# EAGLE schematic schematic_bluepill_basic (EAGLE 9.6.2)
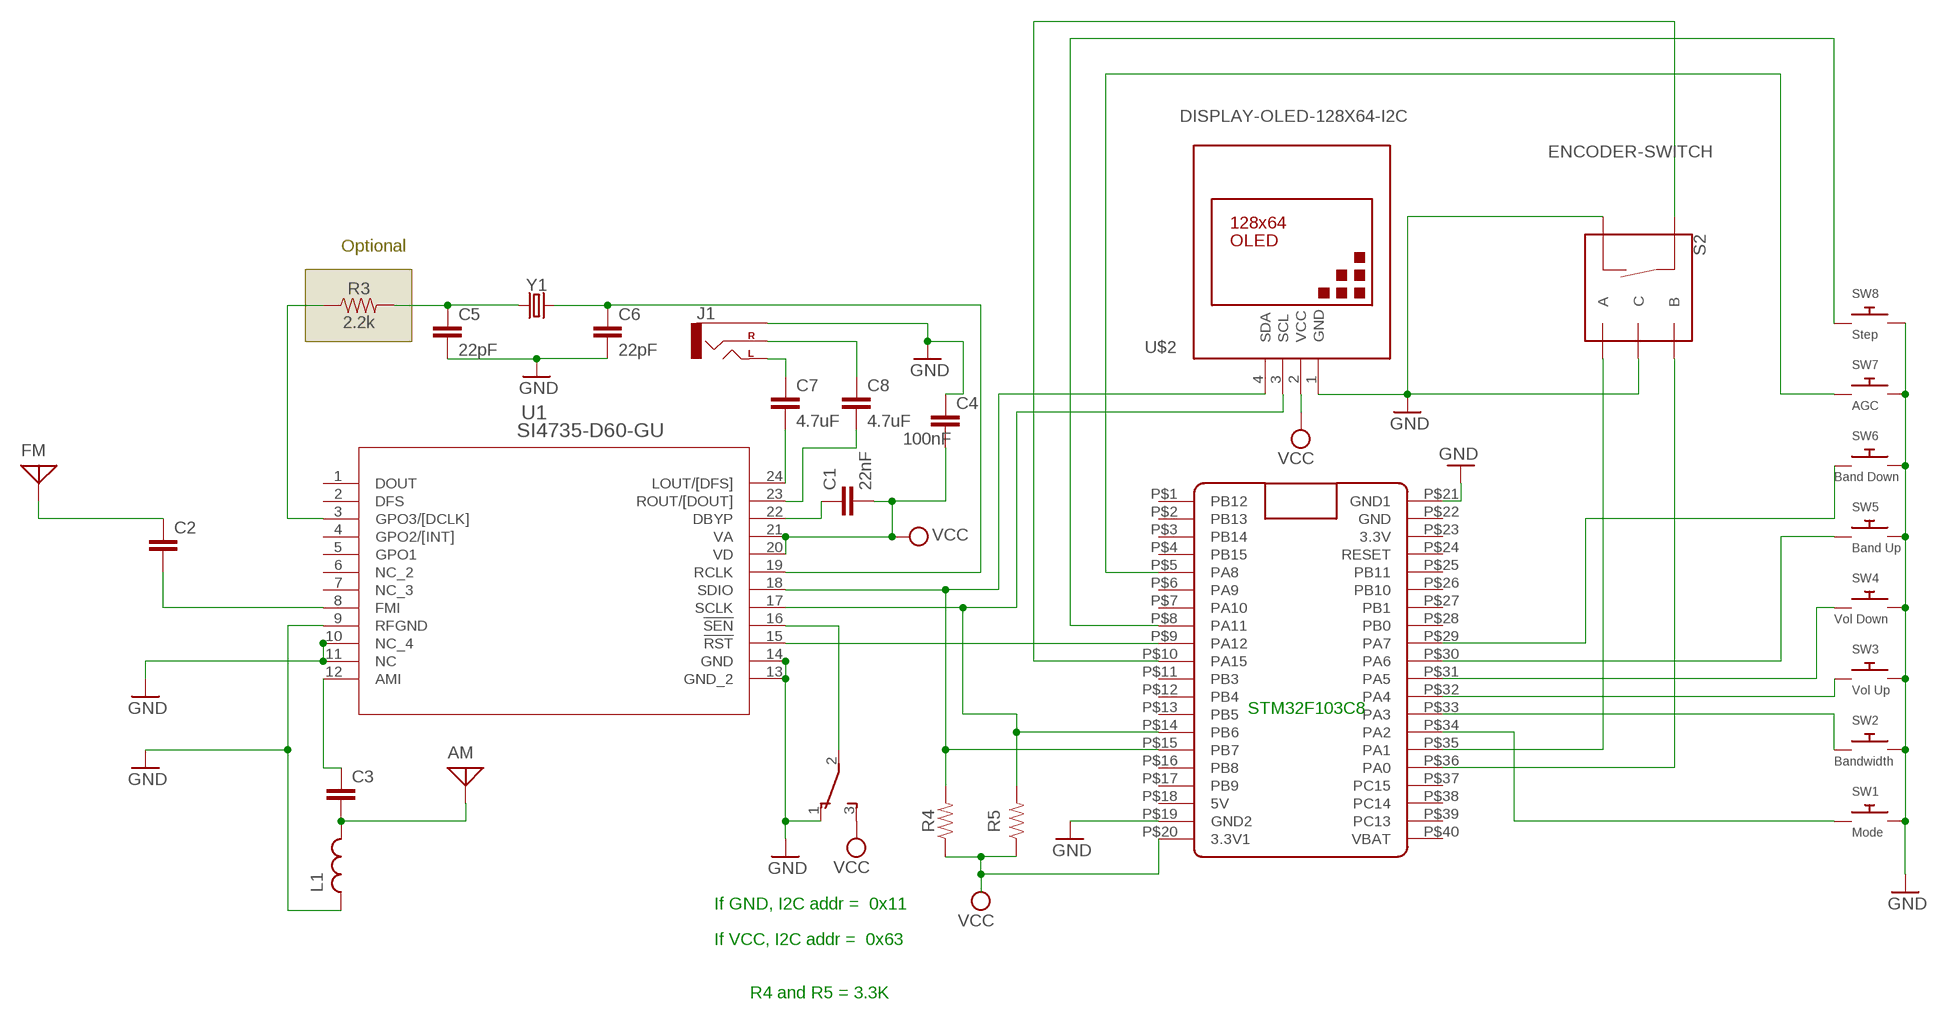
[diagram p0: schematic, sheet 1]

## Parts
AM  ANTENNA  [PAD-01]
C1  22nF  22NF/22,000PF-0603-50V-10%  [0603]
C2  CXXC10B6  [XC10B6]
C3  CXXC10B6  [XC10B6]
C4  100nF  CXXC10B6  [XC10B6]
C5  22pF  22PF-0603-50V-5%  [0603]
C6  22pF  22PF-0603-50V-5%  [0603]
C7  4.7uF  4.7UF-1206-16V-(+80/-20%)  [1206]
C8  4.7uF  4.7UF-1206-16V-(+80/-20%)  [1206]
FM  ANTENNA  [PAD-01]
J1  AUDIO_JACK_2.5MMSPECIAL_POGO_PINS  [STEREOJACK2.5MM_SPECIAL_POGOPINS]
L1  L  (no package)
R3  2.2k  2.2KOHM-0603-1/10W-1%  [0603]
R4  4.7k  4.7KOHM-0603-1/10W-1%  [0603]
R5  4.7k  4.7KOHM-0603-1/10W-1%  [0603]
S1  TL36WO  [TL3XWO]
S2  ENCODER-SWITCH  [ROTARY_ENC_PLAIN]
SW1  Mode  SWITCH_PUSHBUTTONEVQ-PE  [TACT_PANA-EVQ]
SW2  Bandwidth  SWITCH_PUSHBUTTONEVQ-PE  [TACT_PANA-EVQ]
SW3  Vol Up  SWITCH_PUSHBUTTONEVQ-PE  [TACT_PANA-EVQ]
SW4  Vol Down  SWITCH_PUSHBUTTONEVQ-PE  [TACT_PANA-EVQ]
SW5  Band Up  SWITCH_PUSHBUTTONEVQ-PE  [TACT_PANA-EVQ]
SW6  Band Down  SWITCH_PUSHBUTTONEVQ-PE  [TACT_PANA-EVQ]
SW7  AGC  SWITCH_PUSHBUTTONEVQ-PE  [TACT_PANA-EVQ]
SW8  Step  SWITCH_PUSHBUTTONEVQ-PE  [TACT_PANA-EVQ]
U1  SI4735-D60-GU  [SSOP24_SIL]
U$1  BLUE_PILL  [BLUE_PILL]
U$2  DISPLAY-OLED-128X64-I2C  [DISPLAY-OLED-128X64-I2C]
Y1  CRYSTALPTH-2X6  [CRYSTAL-PTH-2X6-CYL]

## Nets
GND: C4.1 C5.2 C6.2 J1.RING1(SLEEVE) L1.1 S1.1(O) S2.C S2.SW- SW1.P$2 SW2.P$2 SW3.P$2 SW4.P$2 SW5.P$2 SW6.P$2 SW7.P$2 SW8.P$2 U1.9(RFGND) U1.10(NC_4) U1.11(NC) U1.13(GND_2) U1.14(GND) U$1.P$19(GND2) U$1.P$21(GND1) U$2.1(GND)
N$1: U1.15(!RST) U$1.P$9(PA12)
N$2: S1.2(P) U1.16(!SEN)
N$3: C6.1 U1.19(RCLK) Y1.2
N$4: C1.1 U1.22(DBYP)
N$5: R3.1 U1.3(GPO3/[DCLK])
N$6: C7.2 U1.24(LOUT/[DFS])
N$7: C8.2 U1.23(ROUT/[DOUT])
N$8: C7.1 J1.SHIELD(LEFT)
N$9: C8.1 J1.TIP(RIGHT)
N$10: AM.1 C3.2 L1.2
N$11: C5.1 R3.2 Y1.1
N$12: C3.1 U1.12(AMI)
N$13: C2.2 U1.8(FMI)
N$14: C2.1 FM.1
N$15: R4.2 U1.18(SDIO) U$1.P$15(PB7) U$2.4(SDA)
N$16: S2.SW+ U$1.P$10(PA15)
N$17: S2.B U$1.P$36(PA0)
N$18: S2.A U$1.P$35(PA1)
N$19: SW1.P$1 U$1.P$34(PA2)
N$20: SW2.P$1 U$1.P$33(PA3)
N$21: SW3.P$1 U$1.P$32(PA4)
N$22: SW4.P$1 U$1.P$31(PA5)
N$23: SW5.P$1 U$1.P$30(PA6)
N$24: SW6.P$1 U$1.P$29(PA7)
N$25: SW7.P$1 U$1.P$5(PA8)
N$26: SW8.P$1 U$1.P$8(PA11)
SDA: R5.2 U1.17(SCLK) U$1.P$14(PB6) U$2.3(SCL)
VCC: C1.2 C4.2 R4.1 R5.1 S1.3(S) U1.20(VD) U1.21(VA) U$1.P$20(3.3V1) U$2.2(VCC)
Unconnected: U1.1(DOUT) U1.2(DFS) U1.4(GPO2/[INT]) U1.5(GPO1) U1.6(NC_2) U1.7(NC_3) U$1.P$1(PB12) U$1.P$2(PB13) U$1.P$3(PB14) U$1.P$4(PB15) U$1.P$6(PA9) U$1.P$7(PA10) U$1.P$11(PB3) U$1.P$12(PB4) U$1.P$13(PB5) U$1.P$16(PB8) U$1.P$17(PB9) U$1.P$18(5V) U$1.P$22(GND) U$1.P$23(3.3V) U$1.P$24(RESET) U$1.P$25(PB11) U$1.P$26(PB10) U$1.P$27(PB1) U$1.P$28(PB0) U$1.P$37(PC15) U$1.P$38(PC14) U$1.P$39(PC13) U$1.P$40(VBAT)

## Notes on the sheet
- Optional
- STM32F103C8
- If GND, I2C addr =  0x11
- If VCC, I2C addr =  0x63
- R4 and R5 = 3.3K

## Library data of the parts
AM FM = discrete:ANTENNA: Antenna
C1 = SparkFun-Capacitors:22NF/22,000PF: 0.022uF/22nF/22,000pF ceramic capacitors A capacitor is a passive two-terminal electrical component used to store electrical energy temporarily in an electric field.; PROD_ID: CAP-07885
C2-C4 = rcl:CX: X CAPACITOR for power line; SPICEPREFIX: C
C5 C6 = SparkFun-Capacitors:22PF: 22pF ceramic capacitors A capacitor is a passive two-terminal electrical component used to store electrical energy temporarily in an electric field.; PROD_ID: CAP-07876
C7 C8 = SparkFun-Capacitors:4.7UF: 4.7µF ceramic capacitors A capacitor is a passive two-terminal electrical component used to store electrical energy temporarily in an electric field.; PROD_ID: CAP-10300
J1 = SparkFun-Connectors:AUDIO_JACK_2.5MM: Audio Jack 2.5mm variants of PTH and SMT audio jacks. SparkFun Products: SparkFun PicoBoard <https://www.sparkfun.com/products/11888>- 2.5mm SMD
L1 = ngspice-simulation:L: INDUCTOR
R3 = SparkFun-Resistors:2.2KOHM: 2.2kΩ resistor A resistor is a passive two-terminal electrical component that implements electrical resistance as a circuit element. Resistors act to reduce current flow, and, at the same time, act to lower voltage levels within circuits. - Wikipedia; PROD_ID: RES-08272
R4 R5 = SparkFun-Resistors:4.7KOHM: 4.7kΩ resistor A resistor is a passive two-terminal electrical component that implements electrical resistance as a circuit element. Resistors act to reduce current flow, and, at the same time, act to lower voltage levels within circuits. - Wikipedia; PROD_ID: RES-07857
S1 = switch:TL36WO: TINY SWITCH ON - ON Source: http://www2.produktinfo.conrad.com/datenblaetter/700000-724999/705152-da-01-de-Subminiaturschalter_TL_36WO.pdf
S2 = SparkFun-Switches:ENCODER-SWITCH: Rotary Encoder w/ Select Switch Encoders rotate similarly to potentiometers, but they’re different from potentiometers in that an encoder has full rotation without limits. They output gray code so that you can tell how much and in which direction the encoder has been turned. This encoder includes a push-down select switch built into the shaft. SparkFun Products Rotary Encoder <https://www.sparkfun.com/products/9117> (COM-09117); SF_SKU: COM-09117
SW1-SW8 = adafruit:SWITCH_PUSHBUTTON: Buttons SOFTTOUCHSMD_SJ - Soft touch temporary push button (Super Junk Akihabara) Compatible with SKPMANE010 [Mouser: 688-SKPMAN] C&K_KSS = Digikey: KSS221GLFS
U1 = si4735:SI4735-D60-GU; BUILT_BY: EMA_Cory; COPYRIGHT: Copyright (C) 2018 Accelerated Designs. All rights reserved; DATASHEET: https://www.silabs.com/documents/public/data-sheets/Si4730-31-34-35-D60.pdf; MANUFACTURER_PART_NUMBER: SI4735-D60-GU; SOURCELIBRARY: Silicon_Labs_2020-04-23; VENDOR: Silicon Labs
U$1 = BluePill:BLUE_PILL
U$2 = diy-modules:DISPLAY-OLED-128X64-I2C: 128x64 Dot Matrix OLED Module based on SSD1306 chip Variant with I2C interface More details available here: http://www.instructables.com/id/Monochrome-096-i2c-OLED-display-with-arduino-SSD13/ SSD1306 datasheet: https://cdn-shop.adafruit.com/datasheets/SSD1306.pdf Click here to find device on ebay.com <http://www.ebay.com/sch/oled+display+128x64+iic> Note: There are two variants: I2C and SPI. Search for the proper version.
Y1 = SparkFun-Clocks:CRYSTAL: Crystals (Generic) These are passive quartz crystals, which can be used as a clock source for a microcontroller. Crystal's are two-terminal devices. They require external "load" capacitors to generate an oscillating signal.